# EAGLE design RH027.2 (EAGLE 7.1.0)
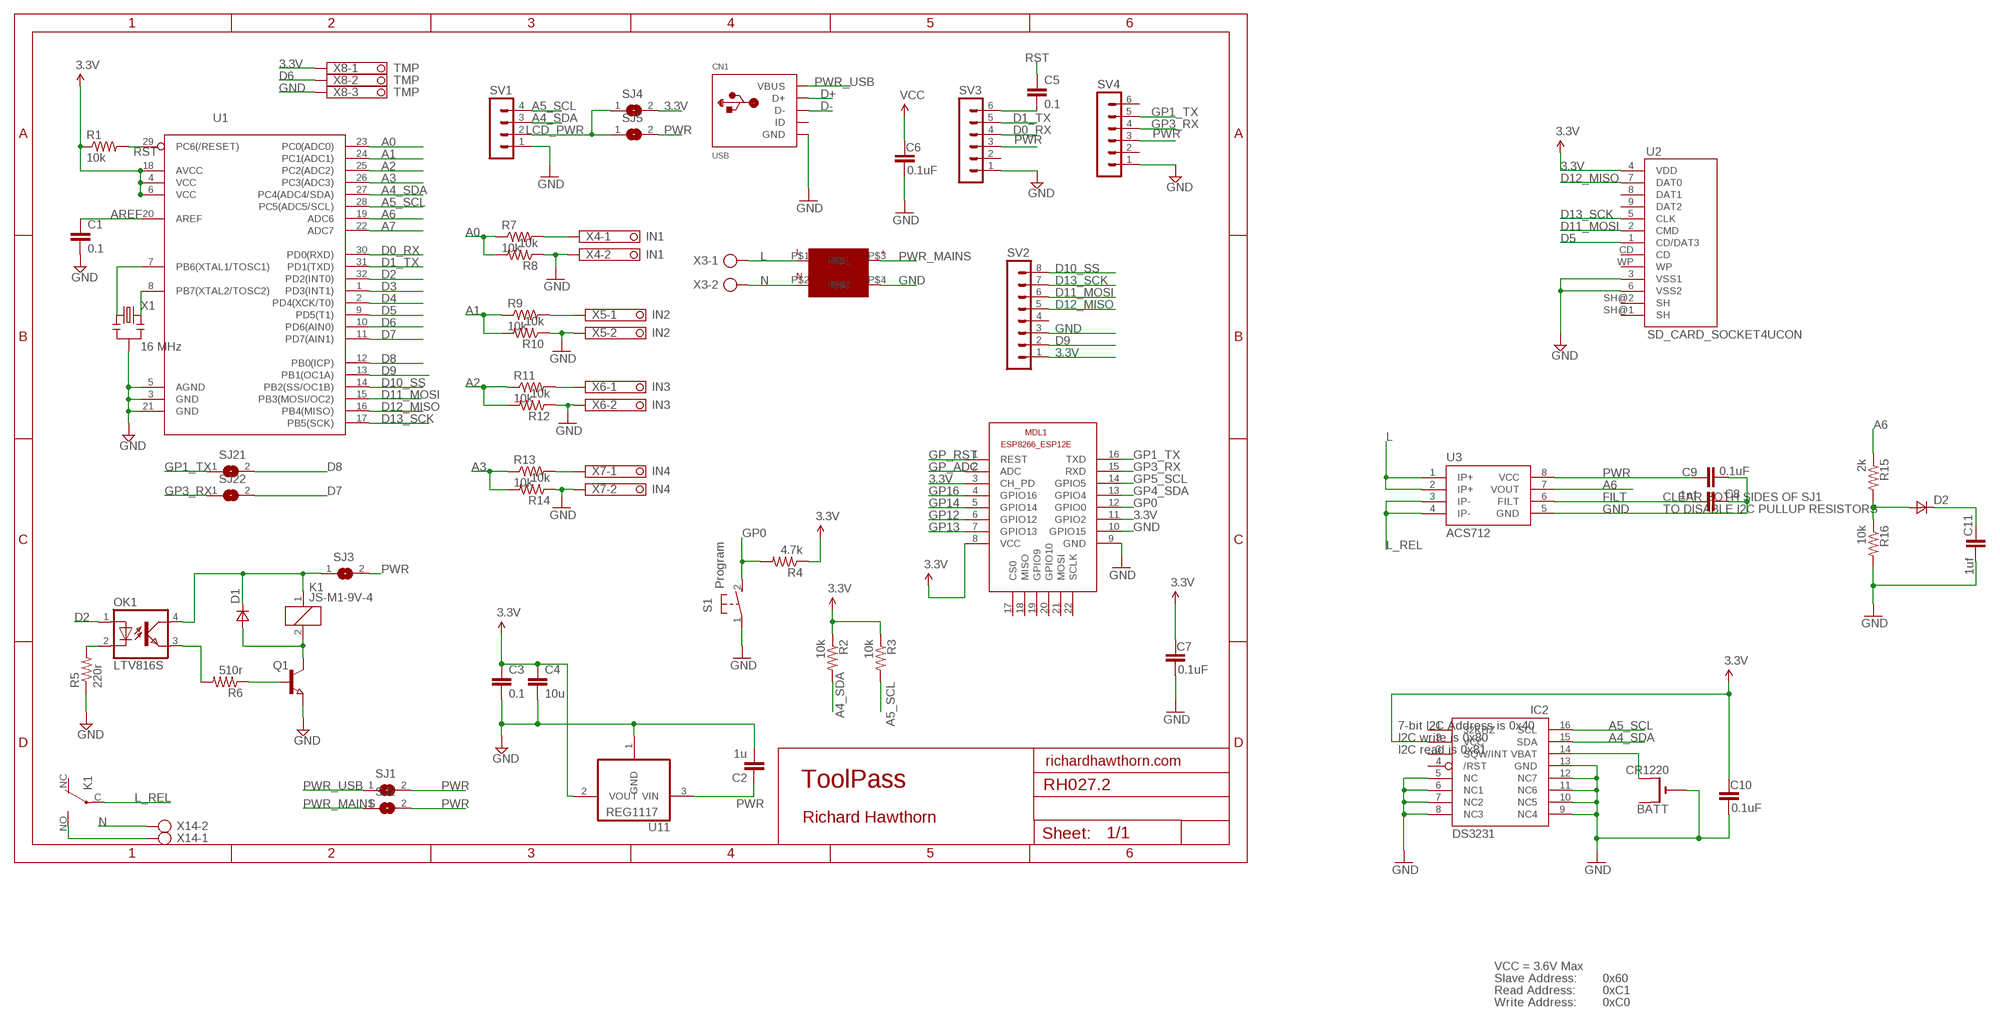
[diagram p0: schematic, sheet 1]

## Parts
BATT  CR1220  CR1220SMT  [CR1220-SMD]
C1  0.1  CAP0603-CAP  [0603-CAP]
C2  1u  CAP0603-CAP  [0603-CAP]
C3  0.1  CAP0603-CAP  [0603-CAP]
C4  10u  CAP0805-CAP  [0805-CAP]
C5  0.1  CAP0603-CAP  [0603-CAP]
C6  0.1uF  0.1UF-25V(+80/-20%)(0603)  [0603-CAP]
C7  0.1uF  0.1UF-25V(+80/-20%)(0603)  [0603-CAP]
C8  1nf  0.1UF-25V(+80/-20%)(0603)  [0603-CAP]
C9  0.1uF  0.1UF-25V(+80/-20%)(0603)  [0603-CAP]
C10  0.1uF  0.1UF-25V(+80/-20%)(0603)  [0603-CAP]
C11  1uf  0.1UF-25V(+80/-20%)(0603)  [0603-CAP]
CN1  USB  USBMINIB  [USB-MINIB]
D1  VAR2SOT23  [SOT-23]
D2  VAR2SOT23  [SOT-23]
IC2  DS3231  DS3231/SO  [SO16W]
K1  JS-M1-9V-4  [JS-M]
MDL1  ESP8266-12EESP8266-ESP12E  [ESP8266-ESP12E]
OK1  LTV816S  [SMD4]
Q1  NPN-TRANSISTOR_SOT23  [SOT23]
R1  10k  RESISTOR0603-RES  [0603-RES]
R2  10k  RESISTOR0805-RES  [0805]
R3  10k  RESISTOR0805-RES  [0805]
R4  4.7k  RESISTOR0805-RES  [0805]
R5  220r  RESISTOR0603-RES  [0603-RES]
R6  510r  RESISTOR0603-RES  [0603-RES]
R7  10k  RESISTOR0603-RES  [0603-RES]
R8  10k  RESISTOR0603-RES  [0603-RES]
R9  10k  RESISTOR0603-RES  [0603-RES]
R10  10k  RESISTOR0603-RES  [0603-RES]
R11  10k  RESISTOR0603-RES  [0603-RES]
R12  10k  RESISTOR0603-RES  [0603-RES]
R13  10k  RESISTOR0603-RES  [0603-RES]
R14  10k  RESISTOR0603-RES  [0603-RES]
R15  2k  RESISTOR0805-RES  [0805]
R16  10k  RESISTOR0805-RES  [0805]
S1  Program  DTSM-3  [DTSM-3]
SJ1  SJ  [SJ]
SJ2  SJ  [SJ]
SJ3  SJ  [SJ]
SJ4  SJ  [SJ]
SJ5  SJ  [SJ]
SJ21  SJ  [SJ]
SJ22  SJ  [SJ]
SV1  MA04-1  [MA04-1]
SV2  MA08-1  [MA08-1]
SV3  MA06-1  [MA06-1]
SV4  MA06-1  [MA06-1]
U1  ATMega-328  ATMEGA168/328TQFP32  [TQFP32-08]
U2  SD_CARD_SOCKET4UCON  [SDCARD_4UCONN]
U3  ACS712  [SO08]
U11  REG1117  [SOT223]
U$1  5VPWR  [5VPWR]
X1  16 MHz  RESONATORSMD  [RESONATOR-SMD]
X3  AK500/2  [AK500/2]
X4  IN1  1751248  [1751248]
X5  IN2  1751248  [1751248]
X6  IN3  1751248  [1751248]
X7  IN4  1751248  [1751248]
X8  TMP  1751251  [1751251]
X14  AK500/2  [AK500/2]

## Nets
3.3V: C3.1 C4.1 C6.1 C7.1 C10.1 IC2.2(VCC) MDL1.3(CH_PD) MDL1.8(VCC) MDL1.11(GPIO2) R1.1 R2.1 R3.1 R4.1 SJ4.2 SV2.1 U1.4(VCC) U1.6(VCC) U1.18(AVCC) U2.4(VDD) U11.2(VOUT) X8.1 ; supply symbol labelled VCC
A0: R7.1 R8.2 U1.23(PC0(ADC0))
A1: R9.1 R10.2 U1.24(PC1(ADC1))
A2: R11.1 R12.2 U1.25(PC2(ADC2))
A3: R13.1 R14.2 U1.26(PC3(ADC3))
A4_SDA: IC2.15(SDA) R2.2 SV1.3 U1.27(PC4(ADC4/SDA))
A5_SCL: IC2.16(SCL) R3.2 SV1.4 U1.28(PC5(ADC5/SCL))
A6: R15.1 U1.19(ADC6) U3.7(VOUT)
A7: U1.22(ADC7)
AREF: C1.1 U1.20(AREF)
D0_RX: SV3.4 U1.30(PD0(RXD))
D1_TX: SV3.5 U1.31(PD1(TXD))
D2: OK1.1(A) U1.32(PD2(INT0))
D3: U1.1(PD3(INT1))
D4: U1.2(PD4(XCK/T0))
D5: U1.9(PD5(T1)) U2.1(CD/DAT3)
D6: U1.10(PD6(AIN0)) X8.2
D7: SJ22.2 U1.11(PD7(AIN1))
D8: SJ21.2 U1.12(PB0(ICP))
D9: SV2.2 U1.13(PB1(OC1A))
D10_SS: SV2.8 U1.14(PB2(SS/OC1B))
D11_MOSI: SV2.6 U1.15(PB3(MOSI/OC2)) U2.2(CMD)
D12_MISO: SV2.5 U1.16(PB4(MISO)) U2.7(DAT0)
D13_SCK: SV2.7 U1.17(PB5(SCK)) U2.5(CLK)
D+: CN1.D+
D-: CN1.D-
FILT: C8.2 U3.6(FILT)
GND [power]: BATT.- C1.2 C2.2 C3.2 C4.2 C6.2 C7.2 C8.1 C9.2 C10.2 C11.2 CN1.GND IC2.5(NC) IC2.6(NC1) IC2.7(NC2) IC2.8(NC3) IC2.9(NC4) IC2.10(NC5) IC2.11(NC6) IC2.12(NC7) IC2.13(GND) MDL1.9(GND) MDL1.10(GPIO15) Q1.2(E) R5.1 R8.1 R10.1 R12.1 R14.1 R16.2 S1.1 SV1.1 SV2.3 SV3.1 SV4.1 U1.3(GND) U1.5(AGND) U1.21(GND) U2.3(VSS1) U2.6(VSS2) U3.5(GND) U11.1(GND) U$1.P$4 X1.2 X4.2 X5.2 X6.2 X7.2 X8.3
GP0: MDL1.12(GPIO0) R4.2 S1.2
GP1_TX: MDL1.16(TXD) SJ21.1 SV4.5
GP3_RX: MDL1.15(RXD) SJ22.1 SV4.4
GP4_SDA: MDL1.13(GPIO4)
GP5_SCL: MDL1.14(GPIO5)
GP12: MDL1.6(GPIO12)
GP13: MDL1.7(GPIO13)
GP14: MDL1.5(GPIO14)
GP16: MDL1.4(GPIO16)
GP_ADC: MDL1.2(ADC)
GP_RST: MDL1.1(REST)
L [mains]: U3.1(IP+) U3.2(IP+) U$1.P$1 X3.1
L_REL [mains]: K1.C(2:P) U3.3(IP-) U3.4(IP-)
LCD_PWR: SJ4.1 SJ5.1 SV1.2
N [mains]: U$1.P$2 X3.2 X14.2
N$2: OK1.3(EMIT) R6.2
N$3: U1.7(PB6(XTAL1/TOSC1)) X1.1
N$4: OK1.2(C) R5.2
N$7 [mains]: K1.NO(2:S) X14.1
N$12: R9.2 X5.1
N$13: R7.2 X4.1
N$14: R11.2 X6.1
N$15: R13.2 X7.1
N$20: C5.2 SV3.6
N$21: U1.8(PB7(XTAL2/TOSC2)) X1.3
N$30: Q1.1(B) R6.1
N$31: D1.3(A) K1.2 Q1.3(C)
N$32: BATT.+$2(+1) IC2.14(VBAT)
N$34: D2.3(A) R15.2 R16.1
N$36: C11.1 D2.1(C)
PWR [power]: C2.1 C9.1 SJ1.2 SJ2.2 SJ3.2 SJ5.2 SV3.3 SV4.3 U3.8(VCC) U11.3(VIN)
PWR_MAINS: SJ2.1 U$1.P$3
PWR_USB [power]: CN1.VBUS SJ1.1
RL_PWR [power]: D1.1(C) K1.1 OK1.4(COL) SJ3.1
RST: C5.1 R1.2 U1.29(PC6(/RESET))
Unconnected: BATT.+$1(+) CN1.ID IC2.1(32KHZ) IC2.3(SQW/INT) IC2.4(/RST) K1.NC(2:O) MDL1.17(CS0) MDL1.18(MISO) MDL1.19(GPIO9) MDL1.20(GPIO10) MDL1.21(MOSI) MDL1.22(SCLK) SV2.4 SV3.2 SV4.2 SV4.6 U2.8(DAT1) U2.9(DAT2) U2.CD U2.SH@1(SH) U2.SH@2(SH) U2.WP

## Notes on the sheet
- CLEAR BOTH SIDES OF SJ1
- TO DISABLE I2C PULLUP RESISTORS
- 7-bit I2C Address is 0x40
- I2C write is 0x80
- I2C read is 0x81
- richardhawthorn.com
- ToolPass
- Richard Hawthorn
- VCC = 3.6V Max
- Slave Address: | 0x60
- Read Address: | 0xC1
- Write Address: | 0xC0

## Library data of the parts
BATT = adafruit:CR1220: CR1216/CR1220/CR1225 12mm 3V lithium coin cell Great for battery packup. Both SMT and THM holders. Note the THM package has the ground pads on both sides of the PCB so that the masks are the same - this reduces the cost
C1-C5 = LowPowerLab:CAP: Capacitor Standard 0603 ceramic capacitor, and 0.1" leaded capacitor.
C6 C7 C9 C10 = SparkFun-Capacitors:0.1UF-25V(+80/-20%)(0603): Ceramic Standard decoupling cap CAP-00810; PROD_ID: CAP-00810
C8 C11 = SparkFun-Capacitors:0.1UF-25V(+80/-20%)(0603): Ceramic Standard decoupling cap CAP-00810; PROD_ID: CAP-00810; VALUE: 0.1uF
CN1 = LowPowerLab:USB: USB Connectors USBMINIB - Surface Mount Female Mini-B USB Connector 4UConnector: 06564 By microbuilder.eu Thru-hole RA Female Mini-B USB Connector 4UConnector: 18732 By ladyada.net
D1 D2 = zetex:VAR2SOT23: DIODE; OC_FARNELL: unknown; OC_NEWARK: unknown
IC2 = adafruit:DS3231
K1 = relay:JS-M1*: Automotive Ultra-Miniature Power Relay NAiS Source: http://www.mew-europe.com/.. en_ds_61211_0000.pdf; OC_FARNELL: unknown; OC_NEWARK: unknown
MDL1 = ESP8266-ESP12E:ESP8266-12E: ESP8266-12E with additional I/O and GPIO04/05 corrected The author cannot warrant that this library is free from error or will meet your specific requirements. Created by PuceBaboon.com. Komagane, Nagano, JAPAN
OK1 = optocoupler:LTV816: OPTO COUPLER Source: LITEON, LTV816.pdf; OC_FARNELL: unknown; OC_NEWARK: unknown
Q1 = semicon-smd-ipc:NPN-TRANSISTOR_: NPN TRANSISTOR
R1 R5-R14 = LowPowerLab:RESISTOR: Resistor Basic schematic elements and footprints for 0603, 1206, and PTH resistors.
R2-R4 R15 R16 = SparkFun:RESISTOR: Resistor Basic schematic elements and footprints for 0603, 1206, and PTH resistors.
S1 = switch-tact:DTSM-3
SJ1-SJ5 SJ21 SJ22 = jumper:SJ: SMD solder JUMPER
SV1 = con-lstb:MA04-1: PIN HEADER; OC_FARNELL: unknown; OC_NEWARK: unknown
SV2 = con-lstb:MA08-1: PIN HEADER; OC_FARNELL: unknown; OC_NEWARK: unknown
SV3 SV4 = con-lstb:MA06-1: PIN HEADER; OC_FARNELL: unknown; OC_NEWARK: unknown
U1 = LowPowerLab:ATMEGA168/328: Atmel 32-pin 8-bit micro, 16k flash.
U2 = SparkFun-Connectors:SD_CARD_SOCKET: SD Memory Card Connector, push-push normal type, CD enable, WP enable
U3 = SparkFun:ACS712
U11 = burr-brown:REG1117: 800mA and 1A Low Dropout (LDO) Positive Regulator 1.8V, 2.5V, 2.85V, 3.3V, 5V, and Adj; MPN: REG1117; OC_FARNELL: 1097566; OC_NEWARK: 14P6981
U$1 = Richards:5VPWR
X1 = SparkFun:RESONATOR: Resonator Small SMD resonator. This is the itty bitty 10/20MHz resonators with built in caps. CSTCE10M0G55 and CSTCE20M0V53. Footprint has been reviewed closely but hasn't been tested yet.
X3 X14 = con-ptr500:AK500/2: CONNECTOR; OC_FARNELL: unknown; OC_NEWARK: unknown
X4-X7 = con-phoenix-350:1751248: MKDS 1/ 2-3,5 Printklemme Nennstrom: 10 A Bemessungsspannung: 160 V Raster: 3,5 mm Polzahl: 2 Montageart: Löten Anschlussart: Schraubanschluss Anschlussrichtung vom Leiter zur Platine: 0° Source: http://eshop.phoenixcontact.com .. 1751248.pdf; OC_FARNELL: unknown; OC_NEWARK: unknown
X8 = con-phoenix-350:1751251: MKDS 1/ 3-3,5 Printklemme Nennstrom: 10 A Bemessungsspannung: 160 V Raster: 3,5 mm Polzahl: 3 Montageart: Löten Anschlussart: Schraubanschluss Anschlussrichtung vom Leiter zur Platine: 0° Source: http://eshop.phoenixcontact.com .. 1751251.pdf; OC_FARNELL: unknown; OC_NEWARK: unknown

## Net classes
1 power: width 0.381 mm, clearance 0.254 mm
2 mains: width 3.048 mm

## Board
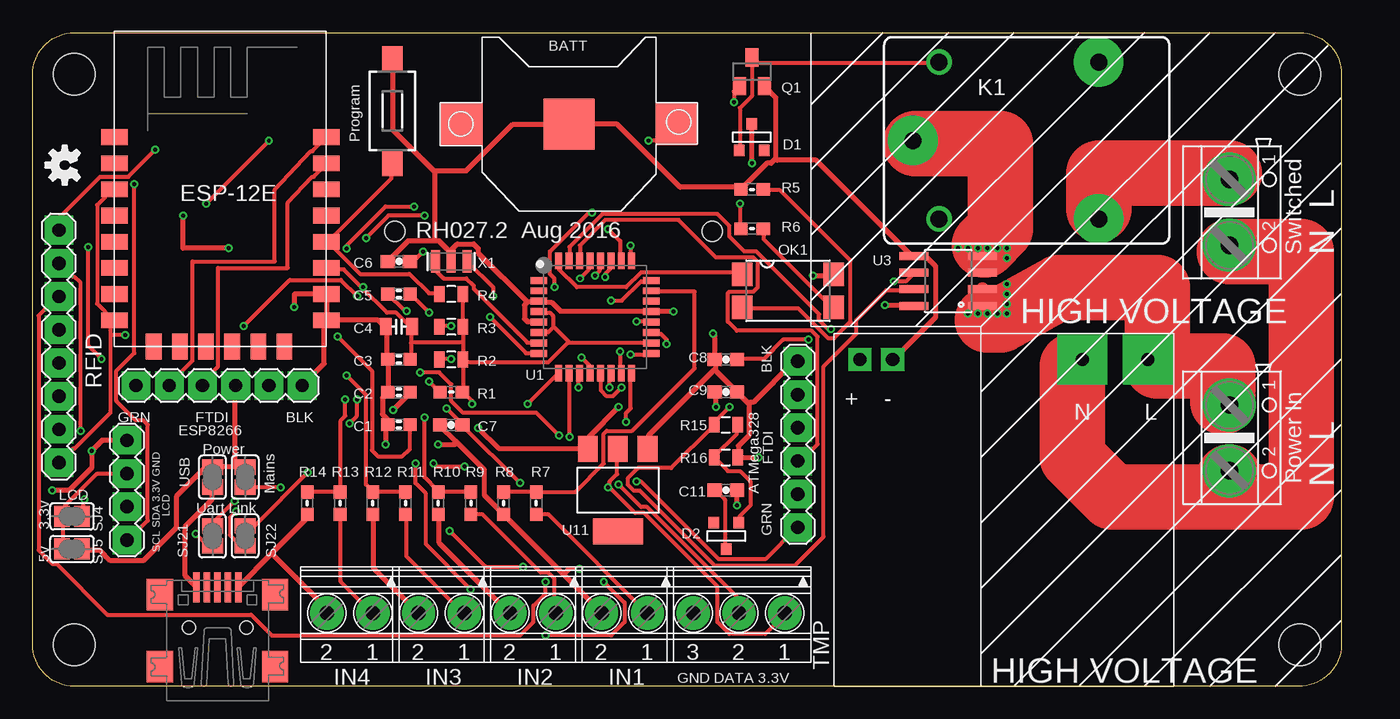
[diagram p1: board, top side]
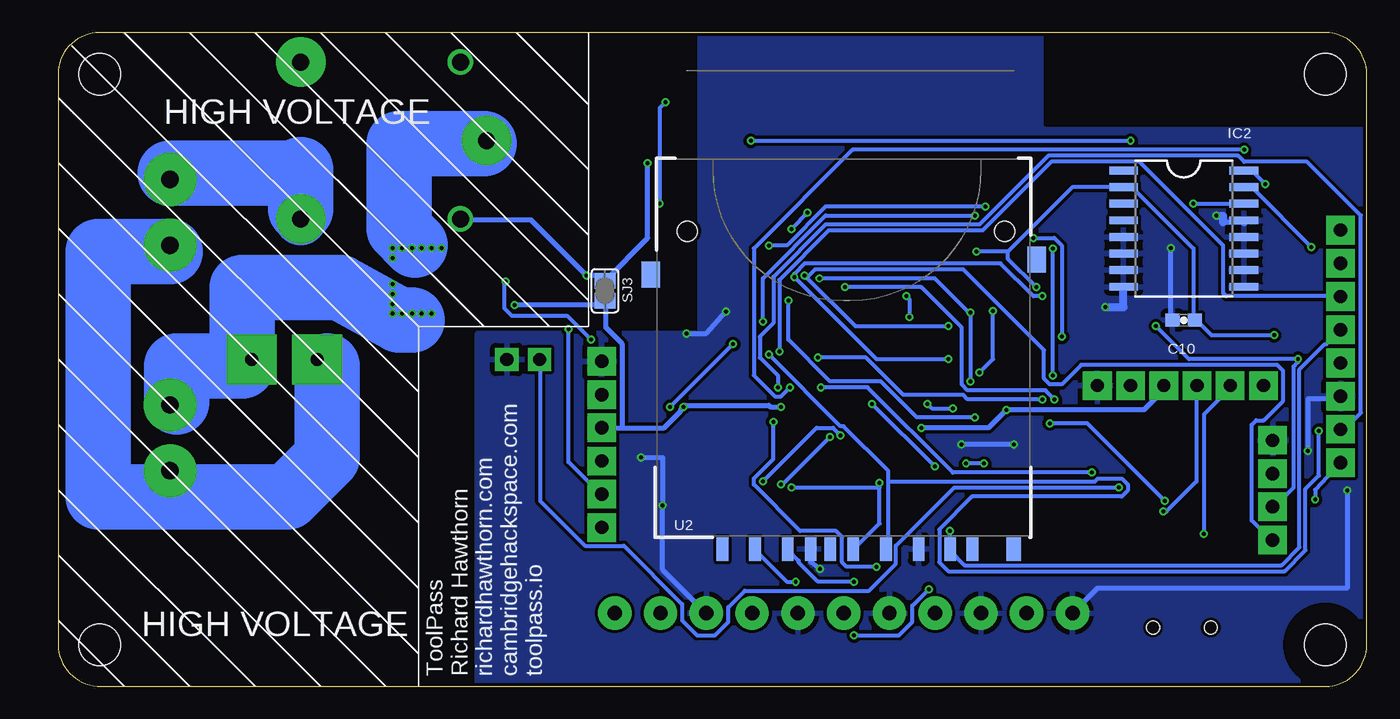
[diagram p2: board, bottom side, seen from below]

Size 100.06 x 49.99 mm. Coordinates in mm from the lower left corner, seen from the top.
Outline: 0,3.17 0,46.81 arc-90 3.17,49.99 96.89,49.99 arc-90 100.06,46.81 100.06,3.17 arc-90 96.76,0 3.17,0 arc-90 0,3.17
Copper layers (1*16): Top 0.035mm / dielectric 1.5mm / Bottom 0.035mm
Design rules "ITEADstudio_DRC *": minimum track width 12mil, minimum drill 12mil, track to track 6mil, track to pad 6mil, pad to pad 6mil, via to via 6mil, smd to smd 0mil, copper to edge 10mil, drill to drill 10mil, minimum pad ring 10mil, minimum via ring 6mil, stop-mask expansion 2mil, vias tented up to drill 100mil, thermal gap 15mil
Holes 3.2 mm at 3.17,3.17 96.89,3.17 3.17,46.81 96.89,46.81
tRestrict: area 0,43 to 24.5,49.8; area 93.9,43.8 to 99.9,49.8; area 93.9,0.2 to 99.9,6.2; area 0.2,0.2 to 6.2,6.2; 1 lines
bRestrict: area 0,43 to 24.5,49.8; area 0.2,0.2 to 6.2,6.2; area 93.9,43.8 to 99.9,49.8; area 93.9,0.2 to 99.9,6.2

### Footprints (pad centres in the part's own frame; a part is rotated, then mirrored left to right if it is on the bottom)
CR1220-SMD = smd 3.2 x 3.2: +$1 -8.2,0; +$2 8.2,0 | smd 3.9 x 3.9: - 0,0
0603-CAP = smd 1.016 x 0.965: 1 -0.85,0; 2 0.85,0
0805-CAP = smd 0.902 x 1.3: 1 -1,0; 2 1,0
0603-CAP' = smd 1.1 x 1: 1 -0.85,0; 2 0.85,0
USB-MINIB = smd 0.5 x 2.308: D+ 0,4.064; D- -0.8,4.064; GND 1.6,4.064; ID 0.8,4.064; VBUS -1.6,4.064 | smd 2 x 2.4: GND1 -4.4,-2; GND2 -4.4,3.5; GND3 4.4,3.5; GND4 4.4,-2 | hole 1: -2.2,1; 2.2,1
SOT-23 = smd 0.787 x 0.889: 1 0.025,-1.016; 2 -0.94,1.016; 3 0.991,1.016
SO16W = smd 0.6 x 2.2: 1 -4.445,-4.6; 2 -3.175,-4.6; 3 -1.905,-4.6; 4 -0.635,-4.6; 5 0.635,-4.6; 6 1.905,-4.6; 7 3.175,-4.6; 8 4.445,-4.6; 9 4.445,4.6; 10 3.175,4.6; 11 1.905,4.6; 12 0.635,4.6; 13 -0.635,4.6; 14 -1.905,4.6; 15 -3.175,4.6; 16 -4.445,4.6
JS-M = drill 1.3: 1 6.7,6; 2 6.7,-6 | drill 1.3 pad 3.81: C 8.7,0; NC -5.5,-6; NO -5.5,6
ESP8266-ESP12E = smd 2 x 1.2: 1 0,16; 2 0,14; 3 0,12; 4 0,10; 5 0,8; 6 0,6; 7 0,4; 8 0,2; 9 16.2,2; 10 16.2,4; 11 16.2,6; 12 16.2,8; 13 16.2,10; 14 16.2,12; 15 16.2,14; 16 16.2,16 | smd 1.2 x 2: 17 11,0; 18 3,0; 19 5,0; 20 13,0; 21 7,0; 22 9,0
SMD4 = smd 1.78 x 1.55: 1 -1.27,-3.5; 2 1.27,-3.5; 3 1.27,3.5; 4 -1.27,3.5
SOT23 = smd 1 x 1.4: 1 -0.95,-1.1; 2 0.95,-1.1; 3 0,1.1
0603-RES = smd 1.016 x 0.965: 1 -0.85,0; 2 0.85,0
0805 = smd 0.8 x 1.2: 1 -0.9,0; 2 0.9,0
DTSM-3 = smd 2 x 1.6: 1 -3.97,0; 2 3.97,0
SJ = smd 1.168 x 1.6: 1 -0.762,0; 2 0.762,0
MA04-1 = drill 1.016 pad 2.184 square: 1 -3.81,0; 2 -1.27,0; 3 1.27,0; 4 3.81,0
MA08-1 = drill 1.016 pad 2.184 square: 1 -8.89,0; 2 -6.35,0; 3 -3.81,0; 4 -1.27,0; 5 1.27,0; 6 3.81,0; 7 6.35,0; 8 8.89,0
MA06-1 = drill 1.016 pad 2.184 square: 1 -6.35,0; 2 -3.81,0; 3 -1.27,0; 4 1.27,0; 5 3.81,0; 6 6.35,0
TQFP32-08 = smd 1.27 x 0.533: 1 -4.293,2.8; 2 -4.293,2; 3 -4.293,1.2; 4 -4.293,0.4; 5 -4.293,-0.4; 6 -4.293,-1.2; 7 -4.293,-2; 8 -4.293,-2.8; 17 4.293,-2.8; 18 4.293,-2; 19 4.293,-1.2; 20 4.293,-0.4; 21 4.293,0.4; 22 4.293,1.2; 23 4.293,2; 24 4.293,2.8 | smd 0.533 x 1.27: 9 -2.8,-4.293; 10 -2,-4.293; 11 -1.2,-4.293; 12 -0.4,-4.293; 13 0.4,-4.293; 14 1.2,-4.293; 15 2,-4.293; 16 2.8,-4.293; 25 2.8,4.293; 26 2,4.293; 27 1.2,4.293; 28 0.4,4.293; 29 -0.4,4.293; 30 -1.2,4.293; 31 -2,4.293; 32 -2.8,4.293
SDCARD_4UCONN = smd 1.8 x 0.9: 1 -1,6.77; 2 -1,4.27; 3 -1,2.52; 4 -1,-0.73; 5 -1,-3.23; 6 -1,-5.73; 7 -1,-8.15; 8 -1,-9.85; 9 -1,9.27; CD -1,1.02 | smd 2 x 1.4: SH@1 20,14.75; SH@2 21.15,-14.75 | smd 1.8 x 1.1: WP -1,-13 | hole 1.55: 23.3,11.94; 23.3,-12.32
SO08 = smd 0.61 x 2.21: 1 -1.905,-2.616; 2 -0.635,-2.616; 3 0.635,-2.616; 4 1.905,-2.616; 5 1.905,2.616; 6 0.635,2.616; 7 -0.635,2.616; 8 -1.905,2.616
SOT223 = smd 1.499 x 2.007: 1 -2.261,-3.15; 2 0.025,-3.15; 3 2.311,-3.15 | smd 3.81 x 2.007: 4 0,3.15
5VPWR = drill 1 pad 3.81 square: P$1 2,2; P$2 7,2 | drill 1 pad 1.778 square: P$3 24,2; P$4 21.5,2
RESONATOR-SMD = smd 0.7 x 1.7: 1 -1.2,0; 2 0,0; 3 1.2,0
AK500/2 = drill 1.321 pad 4.064: 1 -2.515,0; 2 2.515,0
1751248 = drill 1.1 pad 2.54: 1 -1.75,-0.1; 2 1.75,-0.1
1751251 = drill 1.1 pad 2.54: 1 -3.5,-0.1; 2 0,-0.1; 3 3.5,-0.1

### Placement (x,y rotation side)
BATT  41,43 0 top
C1  28,20 180 top
C2  28,22.5 180 top
C3  28,25 180 top
C4  28,27.5 180 top
C5  28,30 180 top
C6  0.1uF  [0603-CAP']  28,32.5 180 top
C7  0.1uF  [0603-CAP']  32,20 180 top
C8  1nf  [0603-CAP']  53,25 0 top
C9  0.1uF  [0603-CAP']  53,22.5 0 top
C10  0.1uF  [0603-CAP']  14,28 180 bottom
C11  1uf  [0603-CAP']  53,15 0 top
CN1  14.13,3.5 0 top
D1  55,42 180 top
D2  53,11.5 0 top
IC2  14,35 270 bottom
K1  76,41.75 180 top
MDL1  6.25,26 0 top
OK1  57.75,30.25 270 top
Q1  55,47 0 top
R1  32,22.5 180 top
R2  32,25 180 top
R3  32,27.5 180 top
R4  32,30 180 top
R5  55,38 0 top
R6  55,35 0 top
R7  38.5,14 270 top
R8  36,14 90 top
R9  33.5,14 270 top
R10  31,14 90 top
R11  28.5,14 270 top
R12  26,14 90 top
R13  23.5,14 270 top
R14  21,14 90 top
R15  53,20 0 top
R16  53,17.5 0 top
S1  27.5,44 270 top
SJ1  13.75,16 90 top
SJ2  16.25,16 90 top
SJ3  58.25,30.25 270 bottom
SJ4  3,13 0 top
SJ5  3,10.5 0 top
SJ21  13.75,11.5 90 top
SJ22  16.25,11.5 90 top
SV1  7.2,15 270 top
SV2  2,26 90 top
SV3  58.5,18.5 270 top
SV4  14.25,23 180 top
U1  43,28.25 0 top
U2  40,11.5 90 bottom
U3  70,31 90 top
U11  44.75,15 180 top
U$1  87.25,27 180 top
U$3  [OSHW-LOGO-S]  2.45,39.85 90 top
X1  32,32.5 0 top
X3  91.5,19 270 top
X4  45.25,5.5 180 top
X5  38.25,5.5 180 top
X6  31.25,5.5 180 top
X7  24.25,5.5 180 top
X8  54,5.5 180 top
X14  91.5,36.25 270 top

### Tracks (layer width: path | path; a pad name or v marks a point on that pad's centre or on a via)
3.3V  (via drill 0.3)
  Top 0.305: 28.9,25.09 C3.1 28.92,25.15 28.92,26.29 | 28.9,27.49 C4.1 | 32.9,25.09 R2.1 | R3.1 | 32.9,22.46 R1.1 | 32.9,20.06 C7.1 | v37.26,15.54 32.92,19.89 C7.1 | 44.12,15.2 44.12,15.66 44.69,16.23 44.69,18.06 U11.2 | 44.12,15.2 46.06,13.26 46.75,13.26 52.35,7.66 52.35,4.92 53.26,4 56.01,4 57.49,5.49 X8.1 | v44.01,15.2 44.12,15.2 | v3.96,14.29 3.66,13.03 SJ4.2 | MDL1.3 6.17,38.06 4.92,36.8 4.92,29.26 6.17,28 MDL1.8 6.17,27.89 5.94,27.66 5.94,26.86 | 5.94,26.86 5.94,20.92 3.2,18.17 3.09,18.17 2.06,17.14 SV2.1 | v29.83,33.26 29.15,32.58 28.92,32.58 C6.1 | 39.78,27.43 39.43,27.09 38.75,27.09 U1.6 | 39.78,27.43 39.78,28.35 39.55,28.57 38.75,28.57 U1.4 | 41.03,26.29 47.21,26.29 U1.18 | 41.03,26.29 39.89,27.43 39.78,27.43 | 28.92,26.29 28.92,27.43 C4.1 | R1.1 32.92,22.63 32.92,24.92 R2.1 | 32.92,26.29 32.92,27.43 R3.1 | 32.92,26.29 32.92,25.15 R2.1 | 32.92,26.29 28.92,26.29 | R4.1 32.92,29.95 32.92,27.66 R3.1 | 25.2,30.46 27.09,28.57 27.77,28.57 28.8,27.55 C4.1 | 25.2,30.46 23.77,31.89 22.52,31.89 MDL1.11 | 41.03,26.29 40.92,26.29 39.43,24.8 33.03,24.8 R2.1 | v25.26,30.52 25.2,30.46 | v7.09,26.86 5.94,26.86 | v31.66,21.26 32.8,20.12 C7.1 | v33.6,21.6 33.6,21.83 33.03,22.4 R1.1
  Bottom 0.305: 37.26,15.2 37.26,12.46 39.2,10.52 U2.4 | 37.26,15.2 v37.26,15.54 | v44.01,15.2 37.26,15.2 | v3.96,14.29 3.96,15.03 2.06,17.03 SV2.1 | 27.43,33.26 v29.83,33.26 | 27.43,33.26 22.52,38.18 18.75,38.18 IC2.2 18.52,38.06 17.83,38.06 13.26,33.49 13.26,28 C10.1 13.03,28 11.89,26.86 v7.09,26.86 | 27.43,33.26 27.43,32.69 v25.26,30.52 | v31.66,21.26 33.26,21.26 v33.6,21.6
A0
  Top 0.305: R8.2 38.41,14.86 R7.1 38.63,14.86 41.49,14.86 43.66,17.03 43.66,19.32 43.89,19.55 45.83,19.55 50.61,24.32 50.61,30.18 47.32,30.18 U1.23
A1  (via drill 0.3)
  Top 0.305: R9.1 31.09,14.86 R10.2 30.98,14.97 29.95,16 v29.95,20.57 | v44.23,29.49 45.03,29.49 46.52,30.98 47.21,30.98 U1.24
  Bottom 0.305: v44.23,29.49 44.23,26.52 41.03,23.32 37.15,23.32 34.4,20.57 v29.95,20.57
A2  (via drill 0.3)
  Top 0.305: R11.1 28.46,14.86 26.06,14.86 R12.2 25.95,14.97 25.49,15.43 25.49,22.29 v24,23.77 | v45.72,33.72 45.72,32.58 U1.25 | v29.15,36.69 26.98,36.69 24,33.72 v24,33.49
  Bottom 0.305: v45.72,33.72 44.35,33.72 41.38,36.69 v29.15,36.69 | v24,23.77 v24,33.49
A3  (via drill 0.3)
  Top 0.305: R14.2 21.03,14.86 23.43,14.86 R13.1 23.55,14.97 23.55,20.34 23.89,20.69 v23.89,21.95 | v44.01,34.98 44.92,34.06 44.92,32.58 U1.26 | v42.75,36.23 42.52,36.23 39.55,33.26 39.55,31.55 39.89,31.2 v39.89,30.52
  Bottom 0.305: v42.75,36.23 v44.01,34.98 | v39.89,30.52 34.06,30.52 30.98,27.43 30.98,23.09 30.52,22.63 24.57,22.63 v23.89,21.95
A4_SDA  (via drill 0.3)
  Top 0.305: v32,25.03 31.2,25.03 R2.2 | v43.78,31.32 43.78,31.55 44.12,31.89 44.12,32.46 U1.27 | v4.23,33.6 4.23,26.06 v5.26,25.03 | v24.8,29.83 23.55,31.09 19.66,31.09 v16.12,27.55
  Bottom 0.305: v32,25.03 37.49,25.03 v43.78,31.32 43.78,31.55 42.98,32.35 28,32.35 25.49,29.83 v24.8,29.83 | v4.23,33.6 8.69,38.06 9.37,38.06 IC2.15 | SV1.3 7.09,13.72 5.6,15.2 5.6,24.46 5.26,24.8 v5.26,25.03 13.6,25.03 v16.12,27.55
A5_SCL  (via drill 0.3)
  Top 0.305: v32,27.55 31.2,27.55 R3.2 | v42.98,31.43 43.32,31.77 43.32,32.46 U1.28 | v7.77,38.41 7.77,25.49 6.4,24.12 6.4,21.83 7.89,20.34 8.46,20.34 8.8,20 8.8,12.69 7.2,11.09 SV1.4
  Bottom 0.305: v32,27.55 39.09,27.55 v42.98,31.43 42.75,31.32 42.18,31.89 30.86,31.89 24.69,25.72 24.69,23.55 24.23,23.09 23.32,23.09 21.83,24.57 6.86,24.57 6.4,24.12 6.4,21.83 7.89,20.34 8.46,20.34 8.8,20 8.8,12.69 7.2,11.09 SV1.4 | v7.77,38.41 8.8,39.43 9.37,39.43 IC2.16
A6  (via drill 0.3)
  Top 0.305: v53.26,21.37 52.12,20.23 52.12,20 R15.1 52.01,19.89 48.81,16.69 46.29,16.69 45.49,15.89 45.49,15.43 45.95,14.97 46.41,14.97 52.12,9.26 58.29,9.26 60.47,11.43 60.47,24.46 62.98,26.98 62.98,28 65.27,30.29 67.32,30.29 U3.7 | v48.46,26.18 48.46,26.52 48.01,26.98 47.32,26.98 U1.19
  Bottom 0.305: v48.46,26.18 v53.26,21.37
AREF  (via drill 0.3)
  Top 0.305: v23.32,26.75 25.95,24.12 25.95,18.05 26.4,17.59 28.25,17.59 28.85,18.14 C1.1 | v25.49,34.29 27.2,36.01 v29.95,36.01 | v46.18,27.89 47.21,27.89 U1.20
  Bottom 0.305: v23.32,26.75 23.32,33.72 23.89,34.29 v25.49,34.29 | v29.95,36.01 41.38,36.01 46.18,31.2 v46.18,27.89
D0_RX
  Top 0.305: U1.30 41.83,32.58 41.83,33.72 43.78,35.66 49.38,35.66 52.23,32.8 55.09,32.8 55.44,32.46 55.44,30.52 55.09,30.18 53.26,30.18 53.15,30.06 53.15,27.89 53.84,27.2 59.55,27.2 60.01,26.75 60.01,18.52 58.75,17.26 58.52,17.26 SV3.4
D1_TX  (via drill 0.3)
  Top 0.305: v61.04,27.32 60.81,27.32 60.12,28 60.12,28.46 55.32,33.26 54.41,33.26 53.26,34.4 53.26,35.2 52.35,36.12 43.55,36.12 41.03,33.6 41.03,32.58 U1.31
  Bottom 0.305: v61.04,27.32 61.04,17.14 58.52,14.63 SV3.5
D2
  Top 0.305: U1.32 40.23,32.46 40.23,31.89 41.6,30.52 45.38,30.52 46.52,31.66 54.06,31.66 54.18,31.55 OK1.1
D5  (via drill 0.3)
  Top 0.305: v37.83,21.6 40.12,23.89 U1.9 | v33.03,16.8 30.86,16.8 v30.63,17.03 | v29.26,17.03 29.26,15.54 30.06,14.74 30.06,10.86 v33.49,7.43 | v39.2,3.89 44.23,3.89 45.26,4.92 45.26,6.4 v43.66,8
  Bottom 0.305: v33.03,16.8 v37.83,21.6 | v29.26,17.03 v30.63,17.03 | v33.49,7.43 34.75,6.17 34.75,4.92 35.78,3.89 v39.2,3.89 | v43.66,8 44.35,8 46.75,10.4 U2.1
D6  (via drill 0.3)
  Top 0.305: v41.03,19.09 41.03,23.89 U1.10 | v44.81,15.43 46.52,13.72 46.98,13.72 53.95,6.74 53.95,5.6 X8.2
  Bottom 0.305: v41.03,19.09 44.69,15.43 v44.81,15.43
D7  (via drill 0.3)
  Top 0.305: v41.72,22.86 41.72,23.89 U1.11 | v21.03,16.34 17.03,12.34 16.34,12.34 SJ22.2
  Bottom 0.305: v41.72,22.86 38.18,22.86 31.66,16.34 v21.03,16.34
D8  (via drill 0.3)
  Top 0.305: v41.95,25.15 42.52,24.57 42.52,24 U1.12 | v24.8,21.95 24.8,20.69 v24.23,20.12 | v15.43,14.17 13.83,12.57 13.83,12.34 SJ21.2
  Bottom 0.305: v41.95,25.15 38.29,25.15 35.43,22.29 30.86,22.29 30.52,21.95 v24.8,21.95 | v24.23,20.12 21.37,20.12 v15.43,14.17
D9  (via drill 0.3)
  Top 0.305: v45.03,22.86 44.35,22.17 43.89,22.17 43.43,22.63 43.43,23.89 U1.13
  Bottom 0.305: v45.03,22.86 45.03,23.77 46.41,25.15 46.41,26.75 45.38,27.77 45.38,31.32 41.38,35.32 29.6,35.32 24.35,40.58 9.83,40.58 9.37,40.12 4.57,40.12 0.46,36.01 0.46,20.92 1.71,19.66 1.94,19.66 SV2.2
D10_SS  (via drill 0.3)
  Top 0.305: v44.12,22.86 44.12,23.89 U1.14 | v9.37,41.03 7.32,38.98 5.14,38.98 2.06,35.89 2.06,34.98 SV2.8
  Bottom 0.305: v44.12,22.86 44.81,22.17 45.26,22.17 46.86,23.77 46.86,33.49 39.32,41.03 v9.37,41.03
D11_MOSI  (via drill 0.3)
  Top 0.305: v44.92,25.6 44.92,24 U1.15 | v39.2,8 39.2,7.09 38.29,6.17 38.29,4.92 37.26,3.89 18.29,3.89 16.69,5.49 5.71,5.49 1.83,9.37 1.49,9.37 0.46,10.4 0.46,28.35 1.94,29.83 SV2.6
  Bottom 0.305: v44.92,25.6 44.92,31.09 41.15,34.86 29.38,34.86 24.12,40.12 17.37,40.12 10.97,33.72 10.97,30.06 10.74,29.83 2.06,29.83 SV2.6 | v39.2,8 41.95,8 43.43,9.49 43.43,9.6 44.23,10.4 U2.2
D12_MISO  (via drill 0.3)
  Top 0.305: v45.38,20.23 45.38,20.92 45.72,21.26 45.72,23.89 U1.16 | v37.49,9.14 34.63,9.14 v31.89,11.89
  Bottom 0.305: v45.38,20.23 45.38,17.37 46.86,15.89 46.86,15.43 43.32,11.89 40.58,11.89 40.12,11.43 40.12,9.49 39.78,9.14 v37.49,9.14 | v31.89,11.89 31.89,10.52 U2.7 31.89,10.4 30.75,9.26 6.51,9.26 5.14,10.63 5.14,24.23 3.2,26.18 3.09,26.18 2.06,27.2 SV2.5
D13_SCK  (via drill 0.3)
  Top 0.305: v45.72,25.38 47.21,25.38 U1.17 | v3.66,19.55 3.66,30.86 3.2,31.32 3.09,31.32 2.06,32.35 SV2.7
  Bottom 0.305: v45.72,25.38 40.23,19.89 40.01,19.89 36.58,16.46 36.58,15.66 | 36.58,15.66 36.58,10.63 36.69,10.52 U2.5 | v3.66,19.55 3.66,16.12 4.69,15.09 4.69,10.4 6.29,8.8 32,8.8 32.69,9.49 32.69,12 30.18,14.52 18.75,14.52 18.29,14.97 18.29,15.43 18.75,15.89 20.57,15.89 20.8,15.66 36.58,15.66
FILT  (via drill 0.3)
  Top 0.305: v59.32,26.52 57.38,26.52 55.89,25.03 53.95,25.03 C8.2 | v65.84,30.98 66.75,30.98 67.32,31.55 U3.6
  Bottom 0.305: v59.32,26.52 61.15,28.35 65.38,28.35 65.95,28.92 65.95,30.86 v65.84,30.98
GND  (via drill 0.3)
  Top 0.381: MDL1.9 22.52,28.12 22.52,29.95 MDL1.10 20,30 v20,29 | 37.83,29.38 37.6,29.15 37.6,28.12 37.83,27.89 38.63,27.89 U1.5 | 37.83,29.38 38.63,29.38 U1.3 38.86,29.38 39.66,29.38 40.35,28.69 47.21,28.69 U1.21 v49,28.65 | 30.75,34.06 31.09,34.06 31.89,33.26 | 30.75,34.06 28.69,34.06 27.2,32.58 C6.2 | 31.89,33.26 31.89,32.58 X1.2 | 30.75,39.32 27.55,42.52 27.55,47.89 S1.1 | 30.75,34.06 30.75,39.32 | 30.75,39.32 30.86,39.43 33.15,39.43 36.69,42.98 40.92,42.98 BATT.- 41.15,42.98 44.69,42.98 49.49,38.18 54.06,38.18 R5.1 54.18,38.06 56.12,40.01 56.46,40.01 56.81,40.35 | 37.83,29.38 34.06,33.15 34.06,33.49 33.72,33.83 32.46,33.83 31.89,33.26 | 52.23,24.23 52.23,24.12 53.84,22.52 C9.2 53.95,22.4 54.75,21.6 | 52.23,24.23 52.23,24.92 C8.1 52.15,26.85 v52,27 | 54.75,21.6 54.75,19.2 53.95,18.4 53.95,17.6 R16.2 v55.5,17.5 | U11.1 47.09,18.17 47.09,19.2 52.12,24.23 52.23,24.23 | 18.29,10.17 15.77,7.66 CN1.GND | 18.29,10.17 20.92,12.8 20.92,13.14 R14.1 | MDL1.9 22.63,28 26.4,28 26.86,27.55 C4.2 27.09,27.43 27.09,25.15 C3.2 27.2,24.92 27.2,22.63 C2.2 27.09,22.4 26.75,22.06 26.75,20.8 27.09,20.46 27.09,20 C1.2 27,20 v27,18.5 | 32.3,18.8 31.2,19.89 C7.2 | 32.3,18.8 34.52,16.57 34.52,14.63 35.89,13.26 R8.1 36.12,13.03 40.58,8.57 | 56.81,40.35 56.81,45.03 56.01,45.83 Q1.2 | R12.1 26.06,13.14 26.06,9.03 X6.2 | R10.1 31.09,13.14 31.09,10.97 36.46,5.6 X5.2 | v53.84,13.83 53.84,14.97 C11.2 | U$1.P$4 65.84,25.03 69.04,28.23 69.04,32.12 68.35,32.8 67.44,32.8 U3.5 67.21,32.92 59.89,40.23 56.92,40.23 56.81,40.35 | 40.58,8.57 43.55,5.6 X4.2 | MDL1.9 22.29,27.89 22.29,24.69 20.69,23.09 SV4.1
  Top 0.381: 18.29,10.17 22.4,6.06 22.4,5.6 X7.2 | 54.75,21.6 54.86,21.72 55.09,21.72 58.18,24.8 58.41,24.8 SV3.1 | v15,33.5 11.5,33.5 v11.5,36 | v41.8,9 41,9 40.58,8.57 | SV1.1 5.31,18.81 v4.5,18 4.5,16.7 2.8,15 v1.5,15 | v31,18.5 32.3,18.5 32.3,18.8
  Bottom 0.381: X8.3 50.52,5.6 53.84,8.91 v53.84,13.83 53.84,17.5 v55.5,17.5 | 15,28 v15,33.5 | 11,35.5 9.4,35.5 | U2.3 42.5,10.5 42.5,9.5 v41.8,9 | v52,27 50.5,27 v49,28.65 | SV2.3 2.19,22 4.5,22 v4.5,18 | v1.5,15 1.5,7.5 20.6,7.5 X7.2 | v27,18.5 v31,18.5
  Bottom 0.61: v20,29 18.6,29 IC2.8 | C10.2 15,28 | v11.5,36 11,36 11,35.5 | 9.4,35.5 IC2.13
  pour Bottom: 0,49.75 0,0 68,0 68,27 51,27 51,49.75
GP0
  Top 0.305: R4.2 31.09,30.06 30.29,30.06 28.8,31.55 25.03,31.55 22.52,34.06 MDL1.12 22.63,34.06 27.43,38.86 27.43,40.01 S1.2
GP1_TX  (via drill 0.3)
  Top 0.305: v12.46,11.66 13.37,10.74 13.72,10.74 SJ21.1 | MDL1.16 22.4,41.95 21.37,40.92 21.26,40.92 18.5,38 18.5,32.5 12.23,32.5 12.23,24.92 10.4,23.09 SV4.5
  Bottom 0.305: v12.46,11.66 12.46,20.8 10.52,22.75 10.52,22.97 SV4.5
GP3_RX  (via drill 0.3)
  Top 0.305: v15.54,13.37 15.09,12.92 15.09,11.54 15.89,10.74 16.23,10.74 SJ22.1 | MDL1.15 22.4,39.89 21.49,38.98 21.37,38.98 19.5,37 19.5,32 14.17,32 14.17,24.46 13.03,23.32 13.03,23.09 SV4.4
  Bottom 0.305: v15.54,13.37 15.32,13.37 13.03,15.66 13.03,22.97 SV4.4
L
  Top 0.813: U3.1 85.25,29.09 U$1.P$1
  Top 1.016: U3.2 U3.1
  Bottom 3: 86,24.5 85.5,25 U$1.P$1 85.5,25.25 85.5,25.5 86,26 | 91,24.5 91.5,24
  Bottom 4: 91.5,24 X3.1
  Bottom 5: 86,24.5 91,24.5 | 86,26 86,30.5 78.5,30.5 74,28 73,28
L_REL
  Top 0.813: U3.3 U3.4 72.62,41.75 K1.C
LCD_PWR
  Top 0.305: SJ5.1 2.29,10.52 2.29,12.92 SJ4.1 2.29,13.14 2.49,13.83 4.89,16.23 7.09,16.23 SV1.2
N
  Bottom 3: X3.2 91.5,14.5 | 79.5,24.5 U$1.P$2 | X14.2 91.5,33.25
  Bottom 5: 79.5,24.5 79.5,17.5 82.5,14.5 91.5,14.5 97,14.5 97,33.25 91.5,33.25
N$1
  Top 5: 91.5,39.25 81.5,39.25 81.5,36.5
N$2
  Top 0.305: R6.2 55.89,34.98 55.89,34.18 61.15,28.92 OK1.3
N$3
  Top 0.305: U1.7 38.63,26.29 37.83,26.29 33.72,30.4 33.72,30.63 33.15,31.2 31.43,31.2 30.86,31.77 30.86,32.46 X1.1
N$4
  Top 0.305: R5.2 55.89,37.95 57.15,37.95 62.52,32.58 62.52,27.89 61.27,26.63 60.81,26.63 58.52,28.92 54.29,28.92 OK1.2
N$5
  Top 5: 86,24.5 91,24.5 91,21.75
N$6
  Top 5: 79.5,24.5 79.5,17.5 82.5,14.5 91.5,14.5 | 91.5,14.5 97,14.5 97,33.25 91.5,33.25 | 91.5,14.5 91.5,16
N$7
  Bottom 3: 91.5,39.25 X14.1
  Bottom 4: K1.NO 81.5,36.5 81.5,39.25
  Bottom 5: 81.5,39.25 91.5,39.25 | 81.5,39.5 81.5,36.5
N$8
  Top 5: 86,25 86,30.5 78.5,30.5 74,28 73,28
N$9
  Bottom 5: 91,21.75 91,22.5
N$11
  Top 5: 67.5,41.5 74,41.5 74,35 72.75,33.75
N$12
  Top 0.305: R9.2 33.6,13.14 34.4,13.14 38.86,8.69 39.43,8.69 39.89,8.23 39.89,5.6 X5.1
N$13
  Top 0.305: R7.2 38.52,13.14 39.43,13.14 46.98,5.6 X4.1
N$14
  Top 0.305: R11.2 28.57,13.14 28.57,9.94 32.92,5.6 X6.1
N$15
  Top 0.305: R13.2 23.55,13.14 23.55,8 25.95,5.6 X7.1
N$16
  Bottom 5: 67.5,41.5 74,41.5 74,35 72.75,33.75
N$17  (via drill 0.3)
  other vias: 71.5,28.5
N$18  (via drill 0.3)
  other vias: 72.25,28.5
N$19  (via drill 0.3)
  other vias: 73,28.5
N$20  (via drill 0.3)
  Top 0.305: C5.2 28.46,28.69 v28.57,28.69 | v29.6,24 31.09,24 32,23.09 32,21.83 32.92,20.92 38.52,20.92 v40.23,19.2 | v46.18,15.66 46.52,15.66 52.46,9.72 56.01,9.72 58.41,12.12 SV3.6
  Bottom 0.305: v28.57,28.69 28.57,25.03 v29.6,24 | v40.23,19.2 40.8,19.77 42.06,19.77 v46.18,15.66
N$21  (via drill 0.3)
  Top 0.305: v34.98,28.23 37.72,25.49 38.63,25.49 U1.8 | v35.2,29.83 35.2,30.52 33.26,32.46 X1.3
  Bottom 0.305: v34.98,28.23 34.98,29.6 v35.2,29.83
N$22  (via drill 0.3)
  Bottom 0.381: v74.5,28.5 v73.75,28.5
N$23  (via drill 0.3)
  other vias: 74.5,29.25
N$24  (via drill 0.3)
  Bottom 0.381: v74.5,30.75 v74.5,30
N$25  (via drill 0.3)
  Bottom 0.381: v71.5,33.5 v70.75,33.5
N$26  (via drill 0.3)
  other vias: 72.25,33.5
N$27  (via drill 0.3)
  other vias: 73,33.5
N$28  (via drill 0.3)
  Bottom 0.381: v73.75,33.5 v74.5,33.5 v74.5,32.75
N$30  (via drill 0.3)
  Top 0.305: v54.06,36.92 54.06,35.09 R6.1 | v53.61,44.69 53.61,45.49 53.95,45.83 Q1.1
  Bottom 0.305: v54.06,36.92 54.06,44.23 v53.61,44.69
N$31
  Top 0.305: D1.3 54.06,41.03 54.06,44.23 54.98,45.15 54.98,48.01 Q1.3 55.09,47.66 69.27,47.66 K1.2
N$32  (via drill 0.3)
  Top 0.305: v18.06,41.72 v13.26,36.92 | v47.09,41.72 47.89,41.72 49.15,42.98 BATT.+$2
  Bottom 0.305: v13.26,36.92 9.49,36.92 IC2.14 | v47.09,41.72 v18.06,41.72
N$34
  Top 0.305: D2.3 54.06,12.57 54.06,13.03 54.86,13.83 54.86,15.66 54.06,16.46 53.15,16.46 52.12,17.49 R16.1 52.12,17.6 53.84,19.32 53.84,19.89 R15.2
N$36
  Top 0.305: D2.1 52.92,10.52 52.92,14.29 52.23,14.97 C11.1
PWR  (via drill 0.3)
  Top 0.381: v52.23,21.37 52.23,22.4 C9.1 | v44.81,21.37 42.52,19.09 42.52,18.17 U11.3 42.29,18.17 35.66,18.17 v34.06,19.77 | v65.15,29.15 67.32,29.15 U3.8 | SJ5.2 3.77,10.4 5.14,10.4 5.94,9.6 8.46,9.6 10.97,12.12 10.97,14.52 13.14,16.69 13.72,16.69 SJ1.2 13.83,16.8 15.43,16.8 | 15.43,16.8 16.23,16.8 SJ2.2 | v27.55,21.14 28.8,22.4 C2.1 | 15.43,16.8 15.43,22.97 SV4.3
  Bottom 0.381: 56.92,19.77 58.41,19.77 SV3.3 | 56.92,19.77 53.72,19.77 52.46,21.03 52.46,21.14 v52.23,21.37 52.12,21.49 45.72,21.49 45.61,21.37 v44.81,21.37 | 56.92,19.77 56.92,26.18 58.18,27.43 58.18,29.38 SJ3.2 58.29,29.15 v65.15,29.15 | SV4.3 15.54,22.97 15.54,22.63 17.03,21.14 v27.55,21.14 28.92,19.77 v34.06,19.77
PWR_MAINS  (via drill 0.3)
  Top 0.305: v18.97,15.2 16.34,15.2 SJ2.1
  Bottom 0.305: v18.97,15.2 31.55,15.2 36.01,10.74 36.01,9.37 38.06,7.32 47.55,7.32 48.81,6.06 48.81,4.92 49.84,3.89 51.21,3.89 52.35,5.03 52.35,6.29 56.81,10.74 59.78,10.74 63.21,14.17 63.21,24.92 U$1.P$3
PWR_USB
  Top 0.381: SJ1.1 13.72,15.2 13.72,14.29 11.66,12.23 11.66,8.46 12.46,7.66 CN1.VBUS
RL_PWR  (via drill 0.3)
  Top 0.381: v54.98,40.01 54.98,42.98 D1.1 | v59.66,31.43 61.15,31.43 OK1.4
  Bottom 0.381: v54.98,40.01 54.98,34.29 58.18,31.09 SJ3.1 58.41,31.09 58.75,31.43 v59.66,31.43 63.89,35.66 69.27,35.66 K1.1
RST  (via drill 0.3)
  Top 0.305: v30.29,23.32 31.09,22.52 R1.2 | v30.29,28.57 28.92,29.95 C5.1 | v41.83,31.2 42.52,31.89 42.52,32.46 U1.29
  Bottom 0.305: v30.29,23.32 v30.29,28.57 30.4,28.57 33.03,31.2 v41.83,31.2

### Text on the board
tPlace: Switched | N L | HIGH VOLTAGE | Power In | N L | HIGH VOLTAGE
bPlace: HIGH VOLTAGE | HIGH VOLTAGE
tNames: RH027.2 Aug 2016 | RFID | BLK | GRN | FTDI | BLK | ATMega328 | ESP8266 | Power | FTDI | USB | Mains | LCD | LCD | Uart Link | 3.3v | GRN | 5v | SCL SDA 3.3V GND | GND DATA 3.3V
bNames: ToolPass / Richard Hawthorn / richardhawthorn.com / cambridgehackspace.com / toolpass.io
tDocu: REG